# EAGLE schematic SMD_Breakout_1 (EAGLE 7.2.0)
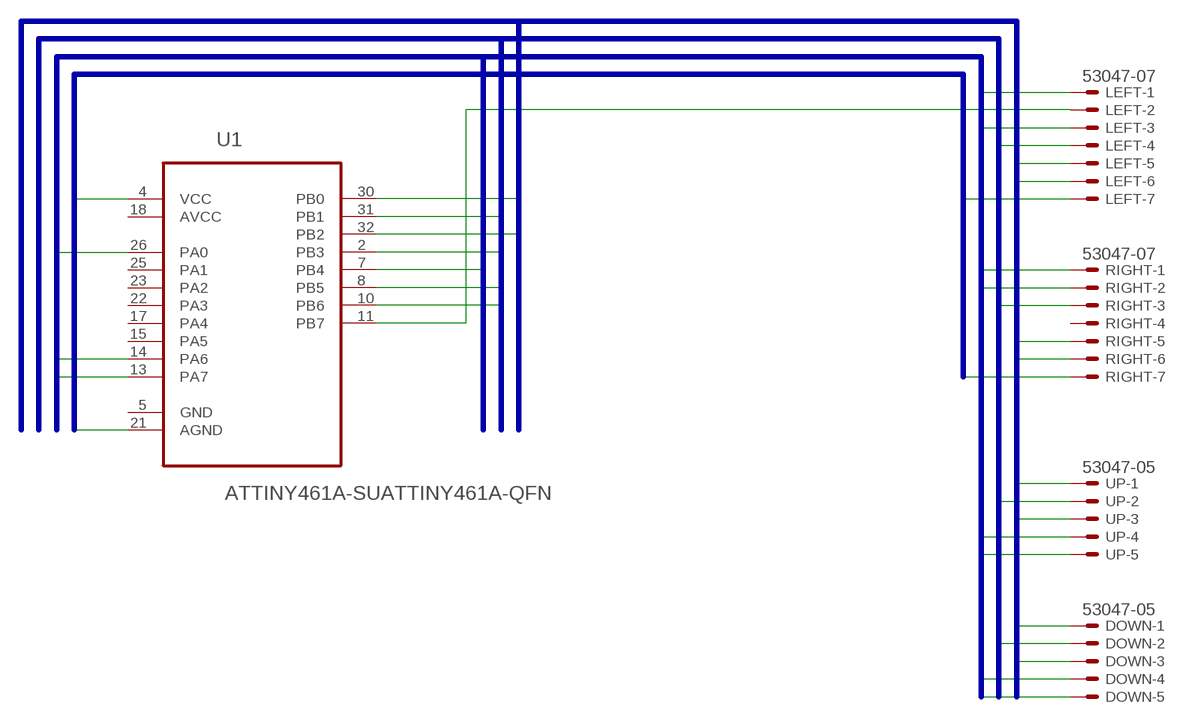
[diagram p0: schematic, sheet 1]

## Parts
DOWN  53047-05  [53047-05]
LEFT  53047-07  [53047-07]
RIGHT  53047-07  [53047-07]
U1  ATTINY461A-SUATTINY461A-QFN  [QFN50P500X500X100-32N]
UP  53047-05  [53047-05]

## Nets
CLK_IN: DOWN.4 LEFT.3 U1.7(PB4)
CLK_OUT: RIGHT.2 U1.14(PA6) UP.4
DOWN: DOWN.2 U1.2(PB3)
GND: RIGHT.7 U1.21(AGND)
LEFT: LEFT.4 U1.31(PB1)
MDO: RIGHT.1 U1.13(PA7) UP.5
N$1: LEFT.2 U1.11(PB7)
RIGHT: RIGHT.3 U1.8(PB5)
SCL: DOWN.3 LEFT.6 RIGHT.6 U1.32(PB2) UP.3
SDA: DOWN.1 LEFT.5 RIGHT.5 U1.30(PB0) UP.1
SDI: DOWN.5 LEFT.1 U1.26(PA0)
UP: U1.10(PB6) UP.2
VDD: LEFT.7 U1.4(VCC)
Unconnected: RIGHT.4 U1.5(GND) U1.15(PA5) U1.17(PA4) U1.22(PA3) U1.23(PA2) U1.25(PA1)

## Buses
SDA,SCL
UP,DOWN,LEFT,RIGHT
CLK_IN,CLK_OUT,MDO,SDI
VDD,GND

## Power pins joined to a net without a drawn wire
AVCC: U1.18(AVCC)

## Library data of the parts
DOWN UP = con-molex:53?-05: CONNECTOR wire to board 1.25 mm (.049 inch) pitch header; MF: MOLEX; MPN: 53047-0510; OC_FARNELL: 9732861; OC_NEWARK: 38C9901
LEFT RIGHT = con-molex:53?-07: CONNECTOR wire to board 1.25 mm (.049 inch) pitch header; MPN: 53047-0710-C; OC_FARNELL: 9732870; OC_NEWARK: 11M0149
U1 = Atmel_By_element14_Batch_1-00:ATTINY461A-SU: 8-bit Microcontroller with In-System Programmable Flash